# Altium project FT2232H.PrjPcb
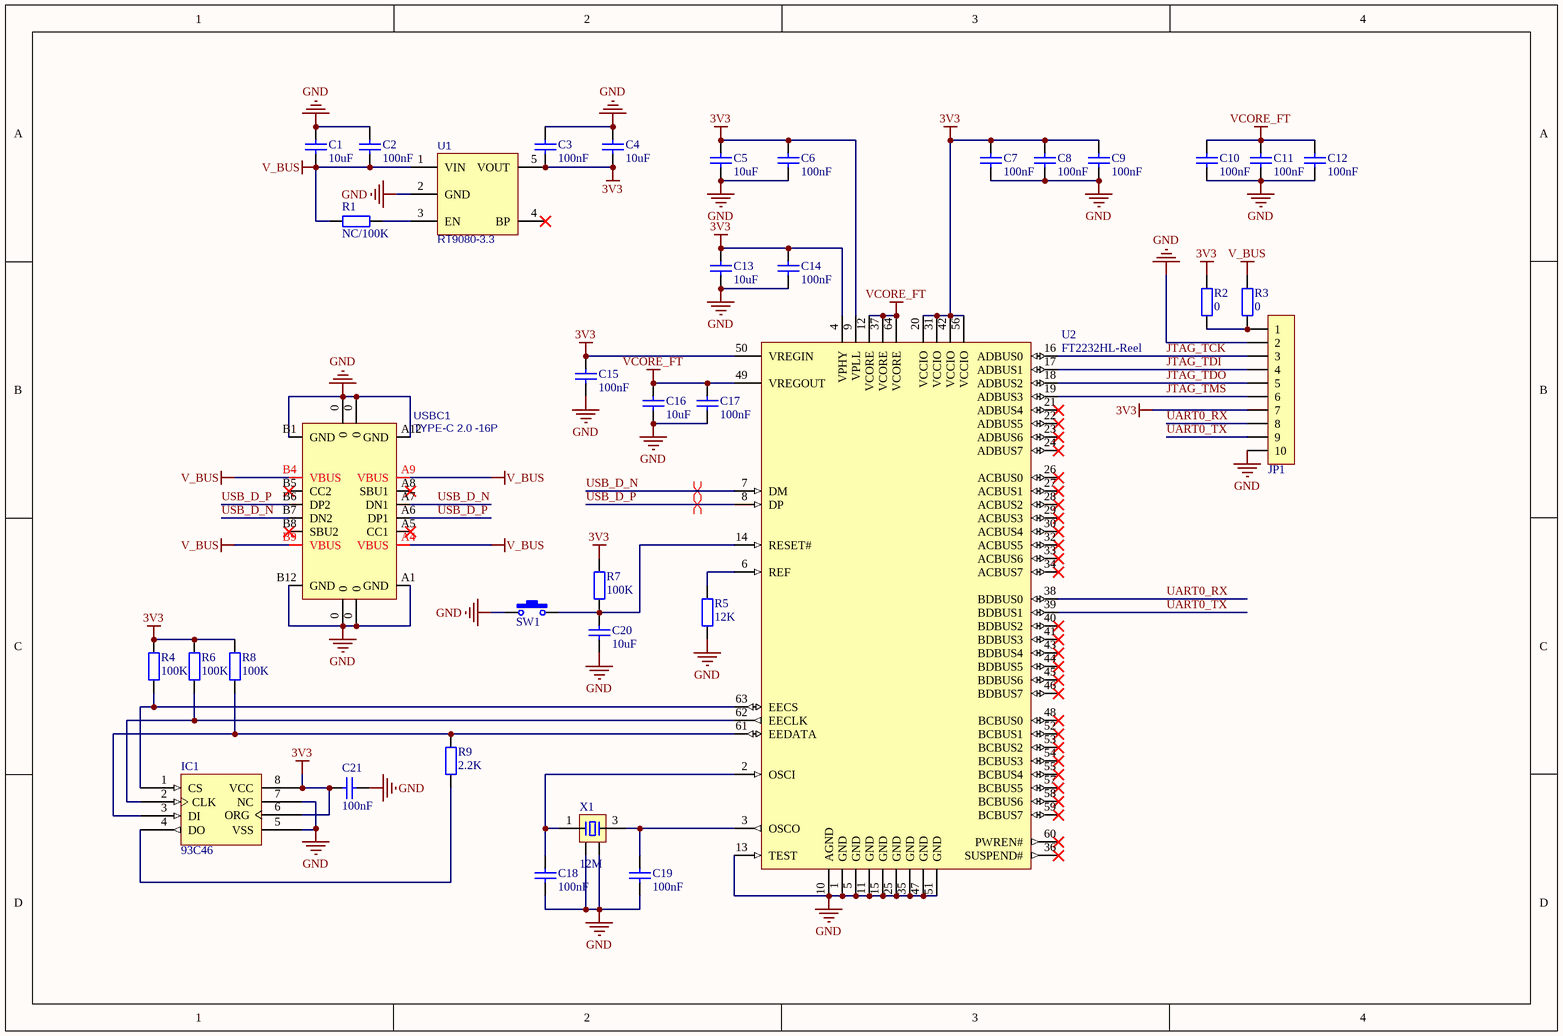
[diagram p0: Debugger.SchDoc]
1 sheet, 37 parts. Net scope: global (net labels, ports and power ports of the same name join across sheets).
Board file: Debugger.PcbDoc

## Sheet Debugger.SchDoc
size A4; SheetNumber: 1; SheetTotal: 1

### Parts
C1  10uF  [C0603_L]
C2  100nF  [C0603_L]
C3  100nF  [C0603_L]
C4  10uF  [C0603_L]
C5  10uF  [C0603_L]
C6  100nF  [C0603_L]
C7  100nF  [C0603_L]
C8  100nF  [C0603_L]
C9  100nF  [C0603_L]
C10  100nF  [C0603_L]
C11  100nF  [C0603_L]
C12  100nF  [C0603_L]
C13  10uF  [C0603_L]
C14  100nF  [C0603_L]
C15  100nF  [C0603_L]
C16  10uF  [C0603_L]
C17  100nF  [C0603_L]
C18  100nF  [C0603_L]
C19  100nF  [C0603_L]
C20  10uF  [C0603_L]
C21  100nF  [C0603_L]
IC1  93C46  [SOP8_L]
JP1  HDR-1X10  [HDR2.54-LI-10P]  (value not drawn)
R1  NC/100K  [R0603_L]
R2  0  [R0603_L]
R3  0  [R0603_L]
R4  100K  [R0603_L]
R5  12K  [R0603_L]
R6  100K  [R0603_L]
R7  100K  [R0603_L]
R8  100K  [R0603_L]
R9  2.2K  [R0603_L]
SW1  3x6x5  [SW SMD-3*6*2.5]  (value not drawn)
U1  RT9080-3.3  [SOT-23-5]
U2  FT2232HL-Reel  [LQFP-64_N]
USBC1  TYPE-C 2.0 -16P  [USB-C-SMD_16P]
X1  12M  [XTAL-2025-4P]

### Nets
3V3: C3.1 C4.1 C5.2 C6.2 C7.2 C8.2 C9.2 C13.2 C14.2 C15.2 C21.1 IC1.6(ORG) IC1.8(VCC) JP1.7 R2.2 R4.2 R6.2 R7.2 R8.2 U1.5(VOUT) U2.4(VPHY) U2.9(VPLL) U2.20(VCCIO) U2.31(VCCIO) U2.42(VCCIO) U2.50(VREGIN) U2.56(VCCIO)
GND: C1.2 C2.2 C3.2 C4.2 C5.1 C6.1 C7.1 C8.1 C9.1 C10.1 C11.1 C12.1 C13.1 C14.1 C15.1 C16.1 C17.1 C18.1 C19.1 C20.1 C21.2 IC1.5(VSS) IC1.7(NC) JP1.2 JP1.10 R5.1 SW1.1 U1.2(GND) U2.1(GND) U2.5(GND) U2.10(AGND) U2.11(GND) U2.13(TEST) U2.15(GND) U2.25(GND) U2.35(GND) U2.47(GND) U2.51(GND) USBC1.0 USBC1.A1(GND) USBC1.A12(GND) USBC1.B1(GND) USBC1.B12(GND) X1.2 X1.4
V_BUS: C1.1 C2.1 R1.1 R3.2 U1.1(VIN) USBC1.A4(VBUS) USBC1.A9(VBUS) USBC1.B4(VBUS) USBC1.B9(VBUS)
VCORE_FT: C10.2 C11.2 C12.2 C16.2 C17.2 U2.12(VCORE) U2.37(VCORE) U2.49(VREGOUT) U2.64(VCORE)
JTAG_TCK: JP1.3 U2.16(ADBUS0)
JTAG_TDI: JP1.4 U2.17(ADBUS1)
JTAG_TDO: JP1.5 U2.18(ADBUS2)
JTAG_TMS: JP1.6 U2.19(ADBUS3)
UART0_RX: JP1.8 U2.38(BDBUS0)
UART0_TX: JP1.9 U2.39(BDBUS1)
USB_D_N: U2.7(DM) USBC1.A7(DN1) USBC1.B7(DN2)
USB_D_P: U2.8(DP) USBC1.A6(DP1) USBC1.B6(DP2)
NetC18_2: C18.2 U2.2(OSCI) X1.1
NetC19_2: C19.2 U2.3(OSCO) X1.3
NetC20_2: C20.2 R7.1 SW1.2 U2.14(RESET#)
NetIC1_1: IC1.1(CS) R4.1 U2.63(EECS)
NetIC1_2: IC1.2(CLK) R6.1 U2.62(EECLK)
NetIC1_3: IC1.3(DI) R8.1 R9.1 U2.61(EEDATA)
NetIC1_4: IC1.4(DO) R9.2
NetJP1_1: JP1.1 R2.1 R3.1
NetR1_2: R1.2 U1.3(EN)
NetR5_2: R5.2 U2.6(REF)

Not connected (* = marked no-connect by the designer): U1 4(BP)*; U2 21(ADBUS4)* 22(ADBUS5)* 23(ADBUS6)* 24(ADBUS7)* 26(ACBUS0)* 27(ACBUS1)* 28(ACBUS2)* 29(ACBUS3)* 30(ACBUS4)* 32(ACBUS5)* 33(ACBUS6)* 34(ACBUS7)* 36(SUSPEND#)* 40(BDBUS2)* 41(BDBUS3)* 43(BDBUS4)* 44(BDBUS5)* 45(BDBUS6)* 46(BDBUS7)* 48(BCBUS0)* 52(BCBUS1)* 53(BCBUS2)* 54(BCBUS3)* 55(BCBUS4)* 57(BCBUS5)* 58(BCBUS6)* 59(BCBUS7)* 60(PWREN#)*; USBC1 A5(CC1)* A8(SBU1)* B5(CC2)* B8(SBU2)*

### Layout directives
differential pair: USB_D_N, USB_D_P

### Library data of the parts
C1-C21 = C: 贴片电容/MLCC电容; BOM名称: 无极性贴片电容; 联系卖家，免费查找封装: 唯一出售店铺网址https://shop463601444.taobao.com
IC1 = 93C46: 外置EEPROM; 联系卖家 免费查找封装: 唯一出售店铺网址https://shop463601444.taobao.com; BOM名称: 外置EEPROM
JP1 = Header 10: 10P接插件; 联系卖家，免费查找封装: 唯一出售店铺网址https://shop463601444.taobao.com; 封装库来自淘宝卖家ID:黄晶宝石: 其他店铺购入均为盗版假冒封装库，请立即申请退款，本店现金奖励20~200元; BOM名称: 10P接插件
R1-R9 = R: 贴片电阻; 联系卖家，免费查找封装: 唯一出售店铺网址https://shop463601444.taobao.com; BOM名称: 贴片电阻
SW1 = SW 3x6: 3x6轻触开关; 联系卖家，免费查找封装: 唯一出售店铺网址https://shop463601444.taobao.com; 封装库来自淘宝卖家ID：黄晶宝石: 其他店铺购入的，请立即申请退款，本店现金奖励20~500元; BOM名称: 3x6轻触开关
U1 = RT9193-18GB: LDO 1.8V/0.3A; 芯片厂商: RICHTEK; 封装库来自淘宝卖家ID：黄晶宝石: 其他店铺购入的买家，请立即申请退款，本店现金奖励20~1000元; BOM名称: RT9193-18GB
U2 = CMP-0078-00023-3: Dual High Speed USB To Multipurpose UART/FIFO IC, 64-pin LQFP, Tape and Reel; Manufacturer: FTDI; DatasheetVersion: ver 2.21, Jun-2012; ComponentLink1URL: http://www.ftdichip.com/; PartNumber: FT2232HL-Reel; ComponentLink2Description: Datasheet; RevisionNote: DatasheetVersion updated to 2.21 Jun-2012; PackageVersion: Jun-12; ComponentLink1Description: Manufacturer URL; ComponentLink2URL: http://www.ftdichip.com/Support/Documents/DataSheets/ICs/DS_FT2232H.pdf; PackageReference: LQFP-64; PackageDescription: 64-Pin Thin Quad Flat Pack, 10 x 10 x 1.4 mm Body, 0.5 mm Pitch
USBC1 = USB2.0_Type-C_16Pin: USB2.0_Type-C_16Pin母座; 联系卖家 免费技术支持: 封装库来自淘宝卖家ID：黄晶宝石
X1 = XTAL-4P: 4脚无源晶振(谐振器）; 联系卖家，免费查找封装: 唯一出售店铺网址https://shop463601444.taobao.com; BOM名称: 4脚无源晶振(谐振器）